# Altium project common-library.PrjPcb
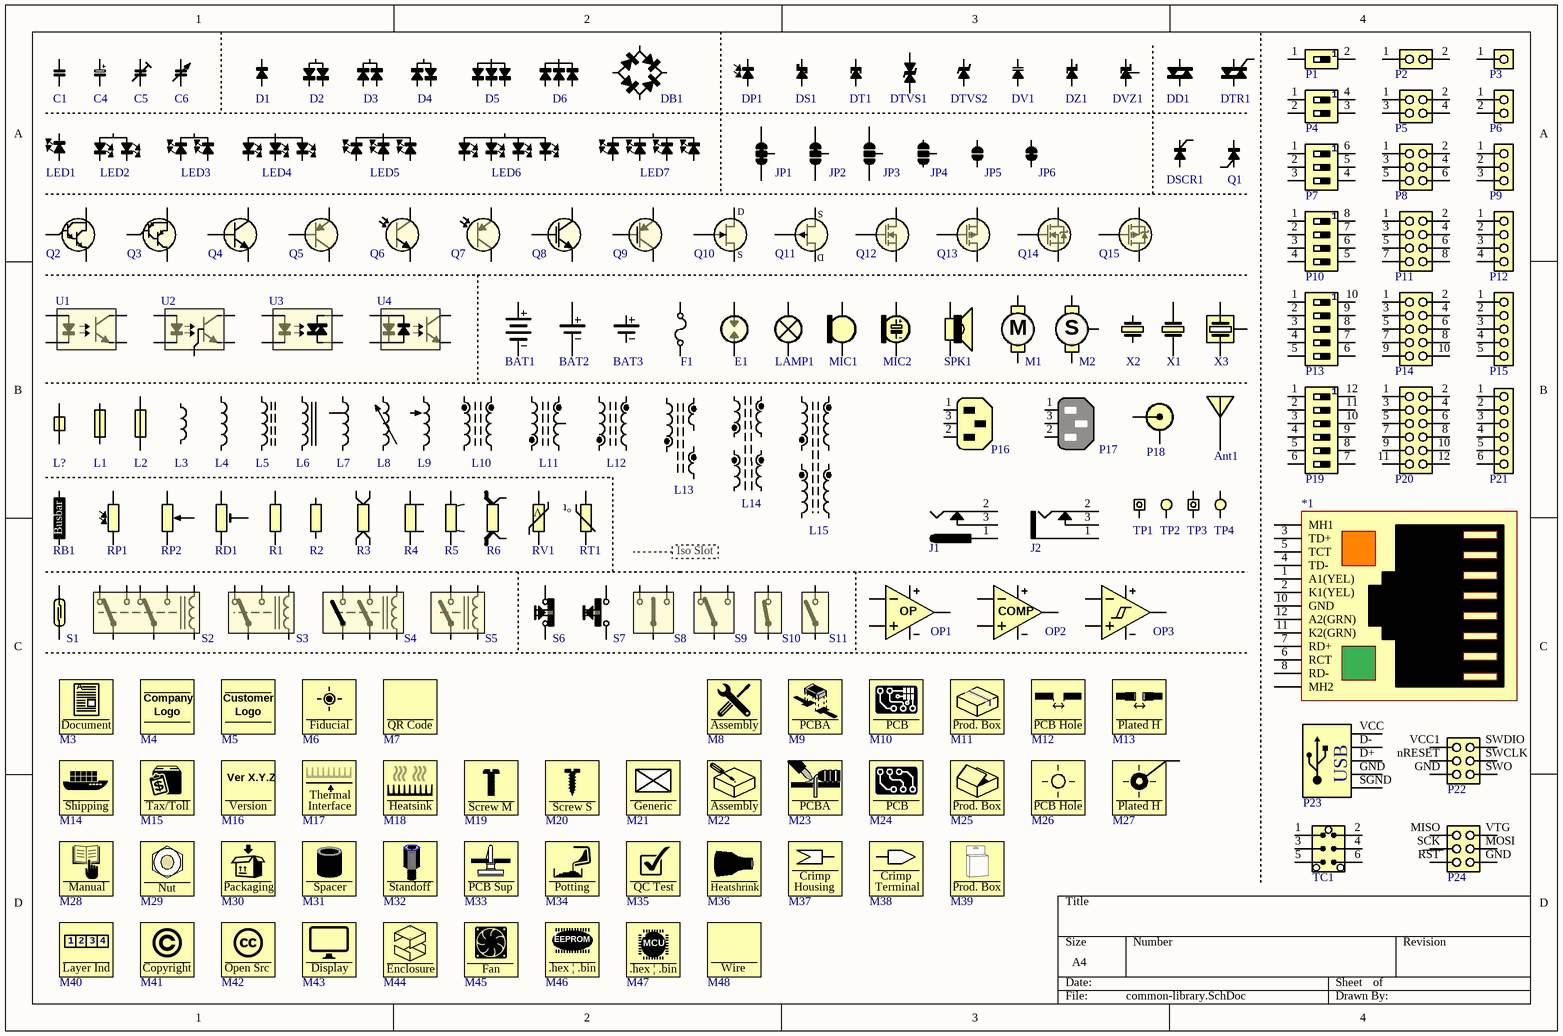
[diagram p0: common-library.SchDoc]
2 sheets, 195 parts. Net scope: global (net labels, ports and power ports of the same name join across sheets).
Sheets:
  common-library.SchDoc
  temp.SchDoc

## Sheet common-library.SchDoc
size A4; PageSetup: Record=PageOptions|CenterHorizontal=True|CenterVertical=True|PrintScale=0.97|XCorrection=1.00|YCorrection=1.00|PrintKind=1|BorderSize=5000000|LeftOffset=0|BottomOffset=0|Orientation=2|PaperLength=2970|PaperWidth=2100|Scale=100|PaperSource=7|PrintQuality=-3|MediaType=1|DitherType=10|PrintScaleMode=1|PaperKind=A4|PaperIndex=9

### Parts
*1  J RJ45  (value not drawn)
*2  Isolation slot  (value not drawn)  (mechanical)
Ant1  Antenna  (value not drawn)
BAT1  BAT Multicell  (value not drawn)
BAT2  BAT Singlecell  (value not drawn)
BAT3  BAT Singlecell (Shortpins)  (value not drawn)
C1  C Capacitor_1  (value not drawn)
C4  C Capacitor Polar  (value not drawn)
C5  C Capacitor Trimmer2  (value not drawn)
C6  C Capacitor Variable2  (value not drawn)
D1  D Diode  (value not drawn)
D2  D Diode 2x Common Anode  (value not drawn)
D3  D Diode 2x Common Cathode  (value not drawn)
D4  D Diode 2x Series  (value not drawn)
D5  D Diode 3x Common Anode  (value not drawn)
D6  D Diode 3x Common Cathode  (value not drawn)
DB1  D Diode Bridge  (value not drawn)
DD1  D Diac  (value not drawn)
DP1  D Photodiode  (value not drawn)
DS1  D Schottky Diode  (value not drawn)
DSCR1  D Thyristor SCR  (value not drawn)
DT1  D Tunnel Diode  (value not drawn)
DTR1  D Triac  (value not drawn)
DTVS1  D TVS Bidirectional  (value not drawn)
DTVS2  D TVS Unidirectional  (value not drawn)
DV1  D Varicap Diode  (value not drawn)
DVZ1  D Variable Zener Diode  (value not drawn)
DZ1  BZX  (value not drawn)
E1  GDT Gas Dischange Tube  (value not drawn)
F1  F Fuse  (value not drawn)
J1  J Low Voltage Power Connector  (value not drawn)
J2  J RCA Phono Jack  (value not drawn)
JP1  JP Solder Jumper 3-way NC/NC  (value not drawn)
JP2  JP Solder Jumper 3-way NC/NO  (value not drawn)
JP3  JP Solder Jumper 3-way NO  (value not drawn)
JP4  JP Solder Jumper 3-way NO_1  (value not drawn)
JP5  JP Solder Jumper NO  (value not drawn)
JP6  JP Solder Jumper NC  (value not drawn)
L1  L Ferrite Bead (Shortpins)  (value not drawn)
L2  L Ferrite Bead (Longpins)  (value not drawn)
L3  L Inductor 2 Small  (value not drawn)
L4  L Inductor 1 Normal  (value not drawn)
L5  L Inductor Ferrite Core  (value not drawn)
L6  L Inductor Iron Core  (value not drawn)
L7  L Inductor Tapped  (value not drawn)
L8  L Inductor Variable  (value not drawn)
L9  L Inductor Variable Tap  (value not drawn)
L10  L Common Mode Choke Ferrite  (value not drawn)
L11  L Transformer Tapped Ferrite Core  (value not drawn)
L12  L Transformer Ferrite Core  (value not drawn)
L13  L Transformer Ferrite Core w Sec Winding  (value not drawn)
L14  L Transformer Ferrite Dual 2  (value not drawn)
L15  L Transformer Ferrite Dual  (value not drawn)
L?  L Ferrite Bead (Shortpins)_1  (value not drawn)
LAMP1  Lamp  (value not drawn)
LED1  D LED  (value not drawn)
LED2  D LED 2x Comm Anode  (value not drawn)
LED3  D LED 2x Comm Cathode  (value not drawn)
LED4  D LED 3x Comm Anode  (value not drawn)
LED5  D LED 3x Comm Cathode  (value not drawn)
LED6  D LED 4x Comm Anode  (value not drawn)
LED7  D LED 4x Comm Cathode  (value not drawn)
M1  Motor DC  (value not drawn)
M2  Motor Servo  (value not drawn)
M3  M Generic Document  (value not drawn)
M4  M Logo Company  (value not drawn)
M5  M Logo Customer  (value not drawn)
M6  M Fiducial PCB Marking  (value not drawn)
M7  M QR Code  (value not drawn)
M8  M Assembly 1  (value not drawn)
M9  M Assembly PCBA  (value not drawn)
M10  M PCB4  (value not drawn)
M11  M Product Box_1  (value not drawn)
M12  M PCB Hole  (value not drawn)
M13  M PCB Hole Plated  (value not drawn)
M14  M Shipping  (value not drawn)
M15  M Tax/Toll  (value not drawn)
M16  M Version Number  (value not drawn)
M17  M Thermal Interface  (value not drawn)
M18  M Heatsink  (value not drawn)
M19  M Screw Machine  (value not drawn)
M20  M Screw Selftapping  (value not drawn)
M21  M Generic  (value not drawn)
M22  M Assembly Box Build 2  (value not drawn)
M23  M Assembly PCBA_1  (value not drawn)
M24  M PCB3  (value not drawn)
M25  M Product Box_2  (value not drawn)
M26  M PCB Hole_1  (value not drawn)
M27  M PCB Hole_1_1  (value not drawn)
M28  M Manual Multipage  (value not drawn)
M29  M Nut  (value not drawn)
M30  M Packaging  (value not drawn)
M31  M PCB Spacer  (value not drawn)
M32  M PCB Standoff  (value not drawn)
M33  M PCB Support  (value not drawn)
M34  M Potting  (value not drawn)
M35  M Quality Control Test  (value not drawn)
M36  M Heatshrink Tube  (value not drawn)
M37  M Crimp Housing  (value not drawn)
M38  M Crimp Terminal  (value not drawn)
M39  M Product Box_3  (value not drawn)
M40  M Layer Indicator  (value not drawn)
M41  M Copyright  (value not drawn)
M42  M Copyright Creative Commons  (value not drawn)
M43  M Display  (value not drawn)
M44  M Enclosure  (value not drawn)
M45  M Fan  (value not drawn)
M46  M Firmware EEPROM Data  (value not drawn)
M47  M Firmware MCU Flash  (value not drawn)
M48  M Wire  (value not drawn)
MIC1  Microphone  (value not drawn)
MIC2  Microphone Polar (Electret)  (value not drawn)
OP1  OP Ampifier  (value not drawn)
OP2  OP Comparator  (value not drawn)
OP3  OP Schmitt Trigger  (value not drawn)
P1  SW DIP Switch, 1 Position, SPST  (value not drawn)
P2  Header 2x1  (value not drawn)
P3  Header 1x1  (value not drawn)
P4  SW DIP Switch, 2 Position, SPST  (value not drawn)
P5  Header 2x2  (value not drawn)
P6  Header 1x2  (value not drawn)
P7  SW DIP Switch, 3 Position, SPST  [PIN pad:20mil hole:10mil]  (value not drawn)
P8  Header 2x3  (value not drawn)
P9  Header 1x3  (value not drawn)
P10  SW DIP Switch, 4 Position, SPST  (value not drawn)
P11  Header 2x4  (value not drawn)
P12  Header 1x4  (value not drawn)
P13  SW DIP Switch, 5 Position, SPST  (value not drawn)
P14  Header 2x5  (value not drawn)
P15  Header 1x5  (value not drawn)
P16  Plug AC Male  (value not drawn)
P17  Plug AC Female  (value not drawn)
P18  J Coaxial Connector  (value not drawn)
P19  SW DIP Switch, 6 Position, SPST  (value not drawn)
P20  Header 2x6  (value not drawn)
P21  Header 1x6  (value not drawn)
P22  Prog Header SWD  (value not drawn)
P23  USB 2.0 PCB Connector  (value not drawn)
P24  Prog ISP AVR  (value not drawn)
Q1  Q PUT Programmable Unijunction Transistor  (value not drawn)
Q2  Q BJT Darlington NPN  (value not drawn)
Q3  Q BJT Darlington PNP  (value not drawn)
Q4  Q BJT Generic NPN  (value not drawn)
Q5  Q BJT Generic PNP  (value not drawn)
Q6  Q BJT Phototransistor NPN  (value not drawn)
Q7  Q BJT Phototransistor PNP  (value not drawn)
Q8  Q IGBT NPN  (value not drawn)
Q9  Q IGBT PNP  (value not drawn)
Q10  Q JFET N-channel  (value not drawn)
Q11  Q JFET P-channel  (value not drawn)
Q12  Q MOSFET NMOS  (value not drawn)
Q13  Q MOSFET PMOS  (value not drawn)
Q14  Q MOSFET NMOS w diode  (value not drawn)
Q15  Q MOSFET PMOS w diode  (value not drawn)
R1  value xxk  (hidden comment: R Resistor (Longpins))
R2  value xxk  (hidden comment: R Resistor (Shortpins))
R3  R Shunt Kelvin  (value not drawn)
R4  R Shunt Kelvin_1  (value not drawn)
R5  R Shunt Kelvin_1  (value not drawn)
R6  R Shunt Kelvin_2  (value not drawn)
RB1  R Busbar  (value not drawn)
RD1  value xxk  (hidden comment: R Preset Divider)
RP1  value xxk  (hidden comment: R Photoresistor)
RP2  value xxk  (hidden comment: R Potentiometer)
RT1  R Thermistor NTC PTC  (value not drawn)
RV1  R Varistor MOV  (value not drawn)
S1  Relay Reed  (value not drawn)
S2  Relay DPDT  (value not drawn)
S3  Relay SPDT  (value not drawn)
S4  Relay DPST  (value not drawn)
S5  Relay SPST  (value not drawn)
S6  SW Push Button SPST NC  (value not drawn)
S7  SW Push Button SPST NO  (value not drawn)
S8  SW Switch SPCO  (value not drawn)
S9  SW Switch SPDT  (value not drawn)
S10  SW Switch SPST NC  (value not drawn)
S11  SW Switch SPST NO  (value not drawn)
SPK1  Speaker  (value not drawn)
TC1  Prog Tag Connect  (value not drawn)
TP1  Testpin  (value not drawn)
TP2  Testpoint  (value not drawn)
TP3  Testpin Inline  (value not drawn)
TP4  Testpoint Inline  (value not drawn)
U1  Q Optoisolator NPN  (value not drawn)
U2  Q Optoisolator NPN with bias  (value not drawn)
U3  Q Optoisolator Triac  (value not drawn)
U4  Q Optoisolator NPN Bidirectional  (value not drawn)
X1  XTAL (Longpins)  (value not drawn)
X2  XTAL (Shortpins)  (value not drawn)
X3  XTAL w Shield  (value not drawn)

### Nets

Not connected (* = marked no-connect by the designer): *1 1(A1(YEL)) 2(K1(YEL)) 3(TD+) 4(TD-) 5(TCT) 6(RCT) 7(RD+) 8(RD-) 10(GND) 11(K2(GRN)) 12(A2(GRN)) MH1 MH2; Ant1 1(ANT); BAT1 1 2; BAT2 1 2; BAT3 1 2; C1 1 2; C4 1 2; C5 1 2; C6 1 2; D1 1(K) 2(A); D2 1(K1) 2(K2) 3(A); D3 1(A1) 2(A2) 3(K); D4 1(K) 2(A) 3; D5 1(K1) 2(K2) 3(K3) 4(A); D6 1(A1) 2(A2) 3(A3) 4(K); DB1 1 2 3 4; DD1 1 2; DP1 1(K) 2(A); DS1 1(K) 2(A); DSCR1 1(C) 2(A) 3(G); DT1 1(K) 2(A); DTR1 1 2 3; DTVS1 1 2; DTVS2 1(K) 2(A); DV1 1(K) 2(A); DVZ1 1(K) 2(A); DZ1 1(K) 2(A); E1 1 2; F1 1 2; J1 1 2 3; J2 1 2 3; JP1 1 2 3; JP2 1 2 3; JP3 1 2 3; JP4 1 2 3; JP5 1 2; JP6 1 2; L1 1 2; L2 1 2; L3 1 2; L4 1 2; L5 1 2; L6 1 2; L7 1 2 3; L8 1 2; L9 1 2 3; L10 1 2 3 4; L11 1 2 3 4 5; L12 1 2 3 4; L13 1 2 3 4 5 6; L14 1 2 3 4 5 6 7 8; L15 1 2 3 4 5 6 7 8; L? 1 2; LAMP1 1 2; LED1 1(K) 2(A); LED2 1(K1) 2(K2) 3(A); LED3 1(A1) 2(A2) 3(K); LED4 1(K1) 2(K2) 3(K3) 4(A); LED5 1(A1) 2(A2) 3(A3) 4(K); LED6 1(K1) 2(K2) 3(K3) 4(K4) 5(A); LED7 1(A1) 2(A2) 3(A3) 4(A4) 5(K); M1 1 2; M2 1 2 3; M27 1; MIC1 1 2; MIC2 1 2; OP1 1(VDD) 2(VSS) 3(Vin-) 4(Vin+) 5(Vout); OP2 1(VDD) 2(VSS) 3(Vin-) 4(Vin+) 5(Vout); OP3 1(VDD) 2(VSS) 3(Vin-) 4(Vin+) 5(Vout); P1 1 2; P2 1 2; P3 1; P4 1 2 3 4; P5 1 2 3 4; P6 1 2; P7 1 2 3 4 5 6; P8 1 2 3 4 5 6; P9 1 2 3; P10 1 2 3 4 5 6 7 8; P11 1 2 3 4 5 6 7 8; P12 1 2 3 4; P13 1 2 3 4 5 6 7 8 9 10; P14 1 2 3 4 5 6 7 8 9 10; P15 1 2 3 4 5; P16 1 2 3(GND); P17 1 2 3(GND); P18 1 2; P19 1 2 3 4 5 6 7 8 9 10 11 12; P20 1 2 3 4 5 6 7 8 9 10 11 12; P21 1 2 3 4 5 6; P22 GND(5) nRESET(3) SWCLK(4) SWDIO(2) SWO(6) VCC1(1); P23 D+(3) D-(2) GND(4) SGND(4) VCC(1); P24 GND(6) MISO(1) MOSI(4) RST(5) SCK(3) VTG(2); Q1 A(1) AG(3) K(2); Q2 1(B) 2(E) 3(C); Q3 1(B) 2(E) 3(C); Q4 1(B) 2(E) 3(C); Q5 1(B) 2(E) 3(C); Q6 1(C) 2(E); Q7 1(E) 2(C); Q8 1(B) 2(C) 3(E); Q9 1(B) 2(E) 3(C); Q10 1(G) 2(D) 3(S); Q11 1(G) 2(S) 3(D); Q12 1(G) 2(D) 3(S); Q13 1(G) 2(S) 3(D); Q14 1(G) 2(D) 3(S); Q15 1(G) 2(S) 3(D); R1 1 2; R2 1 2; R3 1 2; R4 1 2; R5 1 2; R6 1 2; RB1 1 2; RD1 1 2 3; RP1 1 2; RP2 1 2 3; RT1 1 2; RV1 1 2; S1 1 2; S2 1 2 3 4 5 6 7 8; S3 1 2 3 4 5; S4 1 2 3 4 5 6; S5 1 2 3 4; S6 1 2; S7 1 2; S8 3 4 5; S9 3 4 5; S10 1 2; S11 3 4; SPK1 1 2; TC1 1 2 3 4 5 6; TP1 1; TP2 1; TP3 1 2; TP4 1; U1 1(A) 2(K) 3(E) 4(C); U2 1(A) 2(K) 3(E) 4(C) 5(B); U3 1(A) 2(K) 3(T1) 4(T2); U4 1(A) 2(K) 3(E) 4(C); X1 1 2; X2 1 2; X3 1 2

### Notes on the sheet
- (in symbol Isolation slot) Iso Slot
- (in symbol M Assembly 1) Assembly
- (in symbol M Assembly Box Build 2) .; Assembly
- (in symbol M Assembly PCBA) PCBA
- (in symbol M Assembly PCBA_1) PCBA
- (in symbol M Copyright) Copyright
- (in symbol M Copyright Creative Commons) Open Src
- (in symbol M Crimp Housing) Crimp; Housing
- (in symbol M Crimp Terminal) Crimp; Terminal
- (in symbol M Display) Display
- (in symbol M Enclosure) Enclosure
- (in symbol M Fan) Fan
- (in symbol M Fiducial PCB Marking) Fiducial
- (in symbol M Firmware EEPROM Data) EEPROM; .hex | .bin
- (in symbol M Firmware MCU Flash) MCU; .hex | .bin
- (in symbol M Generic) Generic
- (in symbol M Generic Document) A; Document
- (in symbol M Heatshrink Tube) Heatshrink
- (in symbol M Heatsink) Heatsink
- (in symbol M Layer Indicator) 1; 2; 3; 4; Layer Ind
- (in symbol M Logo Company) Company; Logo
- (in symbol M Logo Customer) Customer; Logo
- (in symbol M Manual Multipage) Manual
- (in symbol M Nut) Nut
- (in symbol M Packaging) Packaging
- (in symbol M PCB3) PCB
- (in symbol M PCB4) PCB
- (in symbol M PCB Hole) PCB Hole
- (in symbol M PCB Hole Plated) Plated H
- (in symbol M PCB Hole_1) PCB Hole
- (in symbol M PCB Hole_1_1) Plated H
- (in symbol M PCB Spacer) Spacer
- (in symbol M PCB Standoff) Standoff
- (in symbol M PCB Support) PCB Sup
- (in symbol M Potting) Potting
- (in symbol M Product Box_1) Prod. Box
- (in symbol M Product Box_2) Prod. Box
- (in symbol M Product Box_3) Prod. Box
- (in symbol M QR Code) QR Code
- (in symbol M Quality Control Test) QC Test
- (in symbol M Screw Machine) Screw M
- (in symbol M Screw Selftapping) Screw S
- (in symbol M Shipping) Shipping
- (in symbol M Tax/Toll) Tax/Toll
- (in symbol M Thermal Interface) Thermal; Interface
- (in symbol M Version Number) Ver X.Y.Z; Version
- (in symbol M Wire) Wire
- (in symbol Motor DC) M
- (in symbol Motor Servo) S
- (in symbol OP Ampifier) OP
- (in symbol OP Comparator) COMP
- (in symbol R Busbar) Busbar
- (in symbol R Thermistor NTC PTC) °t
- (in symbol R Varistor MOV) V
- (in symbol USB 2.0 PCB Connector) USB

### Library data of the parts
C1 = C Capacitor_1: Value: XnF
C4 = C Capacitor Polar: Value: XuF
C5 = C Capacitor Trimmer2: Value: XnF
C6 = C Capacitor Variable2: Value: XnF
DTVS1 = D TVS Bidirectional: Value: 10V
DTVS2 = D TVS Unidirectional: Value: 10V
DZ1 = D Zener Diode: Value: 10V
L1 = L Ferrite Bead (Shortpins): Value: xxk
L2 = L Ferrite Bead (Longpins): Value: xxk
L3 = L Inductor 2 Small: Value: ... uH
L4 = L Inductor 1 Normal: Value: ... uH
L5 = L Inductor Ferrite Core: Value: ... uH
L6 = L Inductor Iron Core: Value: ... uH
L7 = L Inductor Tapped: Value: ... uH
L8 = L Inductor Variable: Value: ... uH
L9 = L Inductor Variable Tap: Value: ... uH
L10 = L Common Mode Choke Ferrite: Value: ... uH
L11 = L Transformer Tapped Ferrite Core: Value: ... uH
L12 = L Transformer Ferrite Core: Value: ... uH
L13 = L Transformer Ferrite Core w Sec Winding: Value: ... uH
L14 = L Transformer Ferrite Dual 2: Value: ... uH
L15 = L Transformer Ferrite Dual: Value: ... uH
L? = L Ferrite Bead (Shortpins)_1: Value: xxk
Q1 = Q PUT Programmable Unijunction Transistor: PUT
R3 = R Shunt Kelvin: Value: xxk
R4 R5 = R Shunt Kelvin_1: Value: xxk
R6 = R Shunt Kelvin_2: Value: xxk

## Sheet temp.SchDoc
size A4
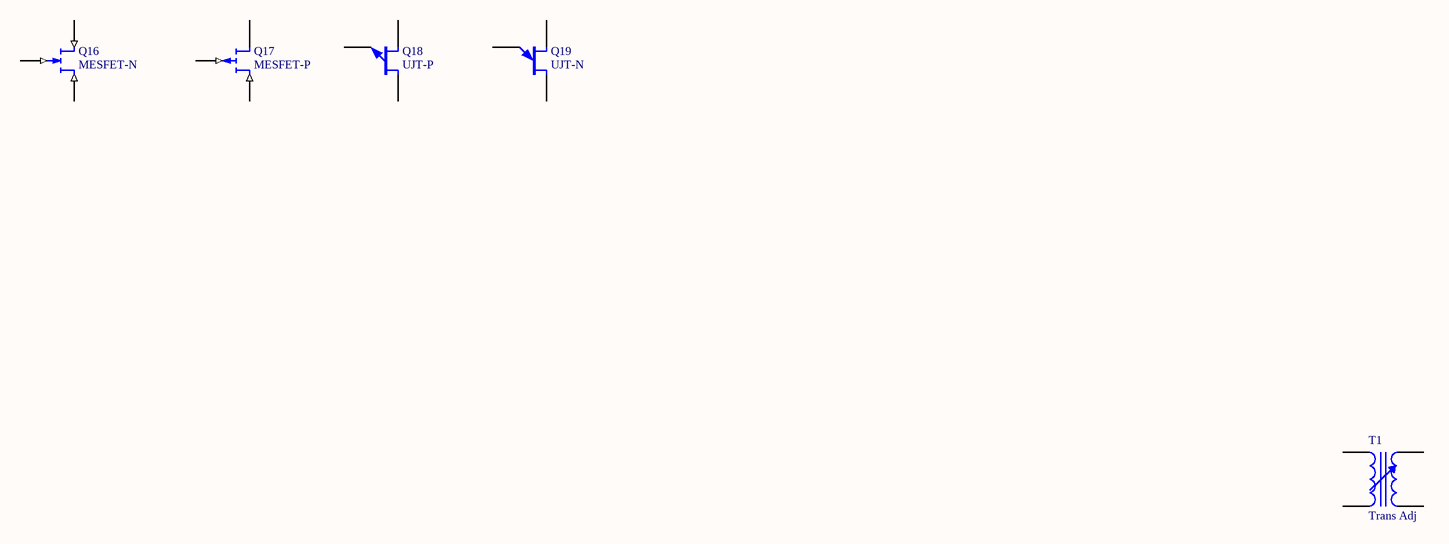
[diagram p1: temp.SchDoc]

### Parts
Q16  MESFET-N  [TO-18]
Q17  MESFET-P  [TO-18]
Q18  UJT-P  [TO-205AF]
Q19  UJT-N  [TO-39]
T1  Trans Adj  [TRF_4]

### Nets

Not connected (* = marked no-connect by the designer): Q16 1(D) 2(G) 3(S); Q17 1(D) 2(G) 3(S); Q18 1(E) 2(B1) 3(B2); Q19 1(E) 2(B1) 3(B2); T1 1 2 3 4

### Library data of the parts
Q16 = MESFET-N: N-Channel MESFET; Published: 8-Jun-2000; LatestRevisionDate: 17-Jul-2002; LatestRevisionNote: Re-released for DXP Platform.; PackageReference: TO-18; Publisher: Altium Limited; PackageDescription: Can; 3 Leads; Pin Circle Dia. 2.54 mm; Lead Dia. 0.48 mm (max); Code_JEDEC: TO-18
Q17 = MESFET-P: P-Channel MESFET; Published: 8-Jun-2000; LatestRevisionDate: 17-Jul-2002; LatestRevisionNote: Re-released for DXP Platform.; PackageReference: TO-18; Publisher: Altium Limited; PackageDescription: Can; 3 Leads; Pin Circle Dia. 2.54 mm; Lead Dia. 0.48 mm (max); Code_JEDEC: TO-18
Q18 = UJT-P: Unijunction Transistor with P-Type Base; Published: 24-Mar-1999; LatestRevisionDate: 17-Jul-2002; LatestRevisionNote: Re-released for DXP Platform.; PackageReference: TO-205AF; Publisher: Altium Limited; PackageDescription: Can; 3 Leads; Pin Circle Dia. 5.08 mm; Lead Dia. 0.53 mm (max); Code_JEDEC: TO-205-AF
Q19 = UJT-N: Unijunction Transistor with N-Type Base; Published: 8-Jun-2000; LatestRevisionDate: 17-Jul-2002; LatestRevisionNote: Re-released for DXP Platform.; PackageReference: TO-39; Publisher: Altium Limited; PackageDescription: Can; 3 Leads; Pin Circle Dia. 5.08 mm; Lead Dia. 0.48 mm (max); Code_JEDEC: TO-205-AF
T1 = Trans Adj: Variable Transformer; Published: 24-Mar-1999; LatestRevisionDate: 17-Jul-2002; LatestRevisionNote: Re-released for DXP Platform.; PackageReference: TRF_4; Publisher: Altium Limited; PackageDescription: Transformer; 4 Leads